# Altium project PCB-LC_LPF6.PrjPcb
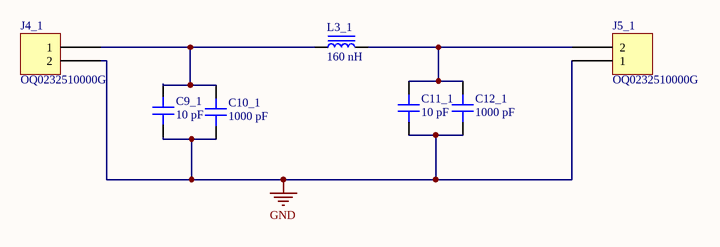
[diagram p0: LC_LPF6.SchDoc]
1 sheet, 7 parts. Net scope: global (net labels, ports and power ports of the same name join across sheets).
Board file: LC_LPF6.PcbDoc

## Sheet LC_LPF6.SchDoc: PCB-FILTER-10
size A4; Author: RAVI DUSI; SheetNumber: 1; SheetTotal: 1

### Parts
C9_1  10 pF  [CAP 0603_1608]
C10_1  1000 pF  [CAP 0603_1608]
C11_1  10 pF  [CAP 0603_1608]
C12_1  1000 pF  [CAP 0603_1608]
J4_1  OQ0232510000G  [FCI 06-381-2PIN]
J5_1  OQ0232510000G  [FCI 06-381-2PIN]
L3_1  160 nH  [IND 0402_1005 RF WW]

### Nets
GND: C9_1.1 C10_1.2 C11_1.1 C12_1.2 J4_1.2 J5_1.1
NetC9_1_2: C9_1.2 C10_1.1 J4_1.1 L3_1.1
NetC11_1_2: C11_1.2 C12_1.1 J5_1.2 L3_1.2

### Notes on the sheet
- DOCUMENT NAME:
- TITLE:
- This document is created by Mitai. Any further questions can be asked through
- AUTHOR :
- REVIEWER:
- Sheet
- PART NO.:
- of
- *
- DATE:
- TEMPLATE:
- team@mitai.ai.
- A4
- Contact Address:Rosenheimer Straße 116b,81669, München.

### Library data of the parts
C9_1 C11_1 = AC0603JRNPO0BN100: CAP CER 10PF 100V C0G/NPO 0603; manufacturer: Yageo; Temperature Coefficient: C0G, NP0; Tolerance: ±5%; Part Number: AC0603JRNPO0BN100; Value: 10 pF; Applications: Automotive; Capacitance: 10 pF; componentlink1description: Datasheet; componentlink1url: http://www.yageo.com/NewPortal/_en/search/productDocs.jsp?YageoPartNumber=AC0603JRNPO0BN100; componentlink2description: DigiKey Link; componentlink2url: https://www.digikey.com/en/products/detail/yageo/AC0603JRNPO0BN100/6643069; Device Package: 0603 (1608 Metric); lastupdated: 04/09/2023 19:08:51; Lifecycle Status: Active; Minimum Order: 1; Mounting Type: Surface Mount, MLCC; Operating Temperature: -55°C ~ 125°C; Package / Case: 0603 (1608 Metric); packaging: TapeAndReel; partid: 2227; Part Status: Active; price: 0.01; Ratings: AEC-Q200; series: AC; Size / Dimension: 0.063" L x 0.031" W (1.60mm x 0.80mm); Supplier 1: DigiKey; Supplier Part Number 1: 311-3083-1-ND; Thickness (Max): 0.035" (0.90mm); Voltage - Rated: 100V
C10_1 C12_1 = GCD188R72A102KA01D: CAP CER 1000PF 100V X7R 0603; manufacturer: Murata Electronics; Tolerance: ±10%; Part Number: GCD188R72A102KA01D; Value: 1000 pF; Applications: Automotive; Capacitance: 1000 pF; componentlink1description: Datasheet; componentlink1url: https://search.murata.co.jp/Ceramy/image/img/A01X/G101/ENG/GCD188R72A102KA01-01.pdf; componentlink2description: DigiKey Link; componentlink2url: https://www.digikey.com/en/products/detail/murata-electronics/GCD188R72A102KA01D/4421520; Device Package: 0603 (1608 Metric); Features: Open Mode; lastupdated: 04/09/2023 19:08:51; Lifecycle Status: Active; Minimum Order: 1; Mounting Type: Surface Mount, MLCC; Operating Temperature: -55°C ~ 125°C; Package / Case: 0603 (1608 Metric); packaging: TapeAndReel; partid: 2238; Part Status: Active; price: 0.01; Ratings: AEC-Q200; series: GCD; Size / Dimension: 0.063" L x 0.031" W (1.60mm x 0.80mm); Supplier 1: DigiKey; Supplier Part Number 1: 490-17739-1-ND; Temperature Coefficient: X7R; Thickness (Max): 0.031" (0.80mm); Voltage - Rated: 100V
J4_1 J5_1 = OQ0232510000G: TERM BLOCK HDR 2POS 90DEG 3.81MM; Manufacturer: Amphenol Anytek; Current - UL: 10A; Header Orientation: 90°, Right Angle; Number of Levels: 1; Number of Positions: 2; Pitch: 0.150" (3.81mm); Voltage - UL: 300V; Part Number: OQ0232510000G; Color: Green; ComponentLink1Description: Datasheet; ComponentLink1URL: http://portal.fciconnect.com/Comergent//fci/drawing/oqxx32x100j0g.pdf; ComponentLink2Description: DigiKey Link; ComponentLink2URL: //digikey.com/product-detail/en/amphenol-anytek/OQ0232510000G/609-3819-ND/2261255; Contact Mating Finish: Tin; LastUpdated: 16/12/2019 19:14:30; Lifecycle Status: 0; Minimum Order: 1; Mounting Type: Through Hole; Operating Temperature: -40°C ~ 115°C; Packaging: Bulk; Part Status: Active; Positions Per Level: 2; Price: 0.49; Series: 06-381; Supplier 1: DigiKey; Supplier Part Number 1: 609-3819-ND; Termination Style: Solder; Type: Header, Male Pins, Shrouded (4 Side)
L3_1 = LQW15CNR16J00D: FIXED IND 160NH 480MA 330MOHM SM; Manufacturer: Murata Electronics; DC Resistance (DCR): 330mOhm Max; Frequency - Self Resonant: 900MHz; Inductance Frequency - Test: 100 MHz; Material - Core: Ferrite; Shielding: Unshielded; Tolerance: ±5%; Type: Drum Core, Wirewound; Part Number: LQW15CNR16J00D; ComponentLink1Description: Datasheet; ComponentLink1URL: https://search.murata.co.jp/Ceramy/image/img/P02/JELF243A-0087.pdf; ComponentLink2Description: DigiKey Link; ComponentLink2URL: https://www.digikey.com/en/products/detail/murata-electronics/LQW15CNR16J00D/4359664; Current Rating (Amps): 480 mA; Device Package: 0402 (1005 Metric); Height - Seated (Max): 0.024" (0.60mm); Inductance: 160 nH; LastUpdated: 03/09/2023 20:25:06; Lifecycle Status: Active; Minimum Order: 1; Mounting Type: Surface Mount; Operating Temperature: -55°C ~ 125°C; Package / Case: 0402 (1005 Metric); Packaging: TapeAndReel; PartId: 1; Part Status: Active; Price: 0.19; Series: LQW15; Size / Dimension: 0.039" L x 0.024" W (1.00mm x 0.60mm); Supplier 1: DigiKey; Supplier Part Number 1: 490-14716-1-ND; Value: 160 nH